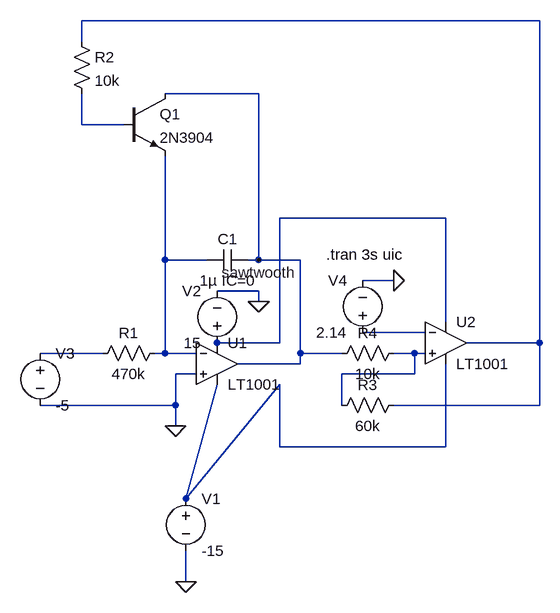
[diagram p0: schematic sawtooth_vco.asc]
sawtooth_vco.asc, the LTspice schematic file:
Version 4.1
SHEET 1 1060 680
WIRE 592 -352 -112 -352
WIRE -112 -320 -112 -352
WIRE 160 -240 16 -240
WIRE -112 -192 -112 -240
WIRE -48 -192 -112 -192
WIRE 448 -48 192 -48
WIRE 16 16 16 -144
WIRE 80 16 16 16
WIRE 160 16 160 -240
WIRE 160 16 144 16
WIRE 224 16 160 16
WIRE 368 48 320 48
WIRE 160 64 96 64
WIRE 160 80 160 64
WIRE 448 112 448 -48
WIRE 416 128 320 128
WIRE 192 144 192 -48
WIRE 192 144 96 144
WIRE 592 144 592 -352
WIRE 592 144 480 144
WIRE -80 160 -176 160
WIRE 16 160 16 16
WIRE 16 160 0 160
WIRE 64 160 16 160
WIRE 224 160 224 16
WIRE 288 160 224 160
WIRE 400 160 368 160
WIRE 416 160 400 160
WIRE 224 176 224 160
WIRE 224 176 128 176
WIRE 64 192 32 192
WIRE 400 192 400 160
WIRE 400 192 288 192
WIRE 32 240 32 192
WIRE 32 240 -176 240
WIRE 288 240 288 192
WIRE 592 240 592 144
WIRE 592 240 368 240
WIRE 32 272 32 240
WIRE 192 304 192 208
WIRE 448 304 448 176
WIRE 448 304 192 304
WIRE 48 384 96 208
WIRE 48 384 192 208
WIRE 48 512 48 464
FLAG 160 80 0
FLAG 48 512 0
FLAG 32 272 0
FLAG 368 48 0
FLAG 160 16 sawtwooth
SYMBOL OpAmps\\LT1001 96 112 R0
SYMATTR InstName U1
SYMBOL voltage 48 368 R0
WINDOW 123 0 0 Left 0
WINDOW 39 0 0 Left 0
SYMATTR InstName V1
SYMATTR Value -15
SYMBOL voltage 96 160 R180
WINDOW 0 24 96 Left 2
WINDOW 3 24 16 Left 2
WINDOW 123 0 0 Left 0
WINDOW 39 0 0 Left 0
SYMATTR InstName V2
SYMATTR Value 15
SYMBOL cap 144 0 R90
WINDOW 0 0 32 VBottom 2
WINDOW 3 32 32 VTop 2
SYMATTR InstName C1
SYMATTR Value 1µ IC=0
SYMBOL res 16 144 R90
WINDOW 0 0 56 VBottom 2
WINDOW 3 32 56 VTop 2
SYMATTR InstName R1
SYMATTR Value 470k
SYMATTR SpiceLine tol=5
SYMBOL voltage -176 144 R0
WINDOW 123 0 0 Left 0
WINDOW 39 0 0 Left 0
SYMATTR InstName V3
SYMATTR Value -5
SYMBOL voltage 320 144 R180
WINDOW 0 24 96 Left 2
WINDOW 3 24 16 Left 2
WINDOW 123 0 0 Left 0
WINDOW 39 0 0 Left 0
SYMATTR InstName V4
SYMATTR Value 2.14
SYMBOL npn -48 -240 R0
SYMATTR InstName Q1
SYMATTR Value 2N3904
SYMBOL res -128 -336 R0
SYMATTR InstName R2
SYMATTR Value 10k
SYMBOL OpAmps\\LT1001 448 80 R0
SYMATTR InstName U2
SYMBOL res 384 144 R90
WINDOW 0 0 56 VBottom 2
WINDOW 3 32 56 VTop 2
SYMATTR InstName R4
SYMATTR Value 10k
SYMBOL res 384 224 R90
WINDOW 0 0 56 VBottom 2
WINDOW 3 32 56 VTop 2
SYMATTR InstName R3
SYMATTR Value 60k
TEXT 264 8 Left 2 !.tran 3s uic

The netlist it stands for:
* sawtooth_vco.asc
X§U1 0 N004 N003 N008 sawtwooth LT1001  ; pins In+ In- V+ V- OUT
V1 N008 0 -15
V2 N003 0 15
C1 sawtwooth N004 1µ IC=0
R1 N004 N006 470k tol=5
V3 N006 0 -5
V4 N005 0 2.14
Q1 sawtwooth N002 N004 0 2N3904
R2 N001 N002 10k
X§U2 N007 N005 N003 N008 N001 LT1001  ; pins In+ In- V+ V- OUT
R4 N007 sawtwooth 10k
R3 N001 N007 60k
.model NPN NPN
.model PNP PNP
.lib standard.bjt
.tran 3s uic
.lib LTC.lib
.backanno
.end